# EAGLE schematic VCAMixer (EAGLE 7.6.0)
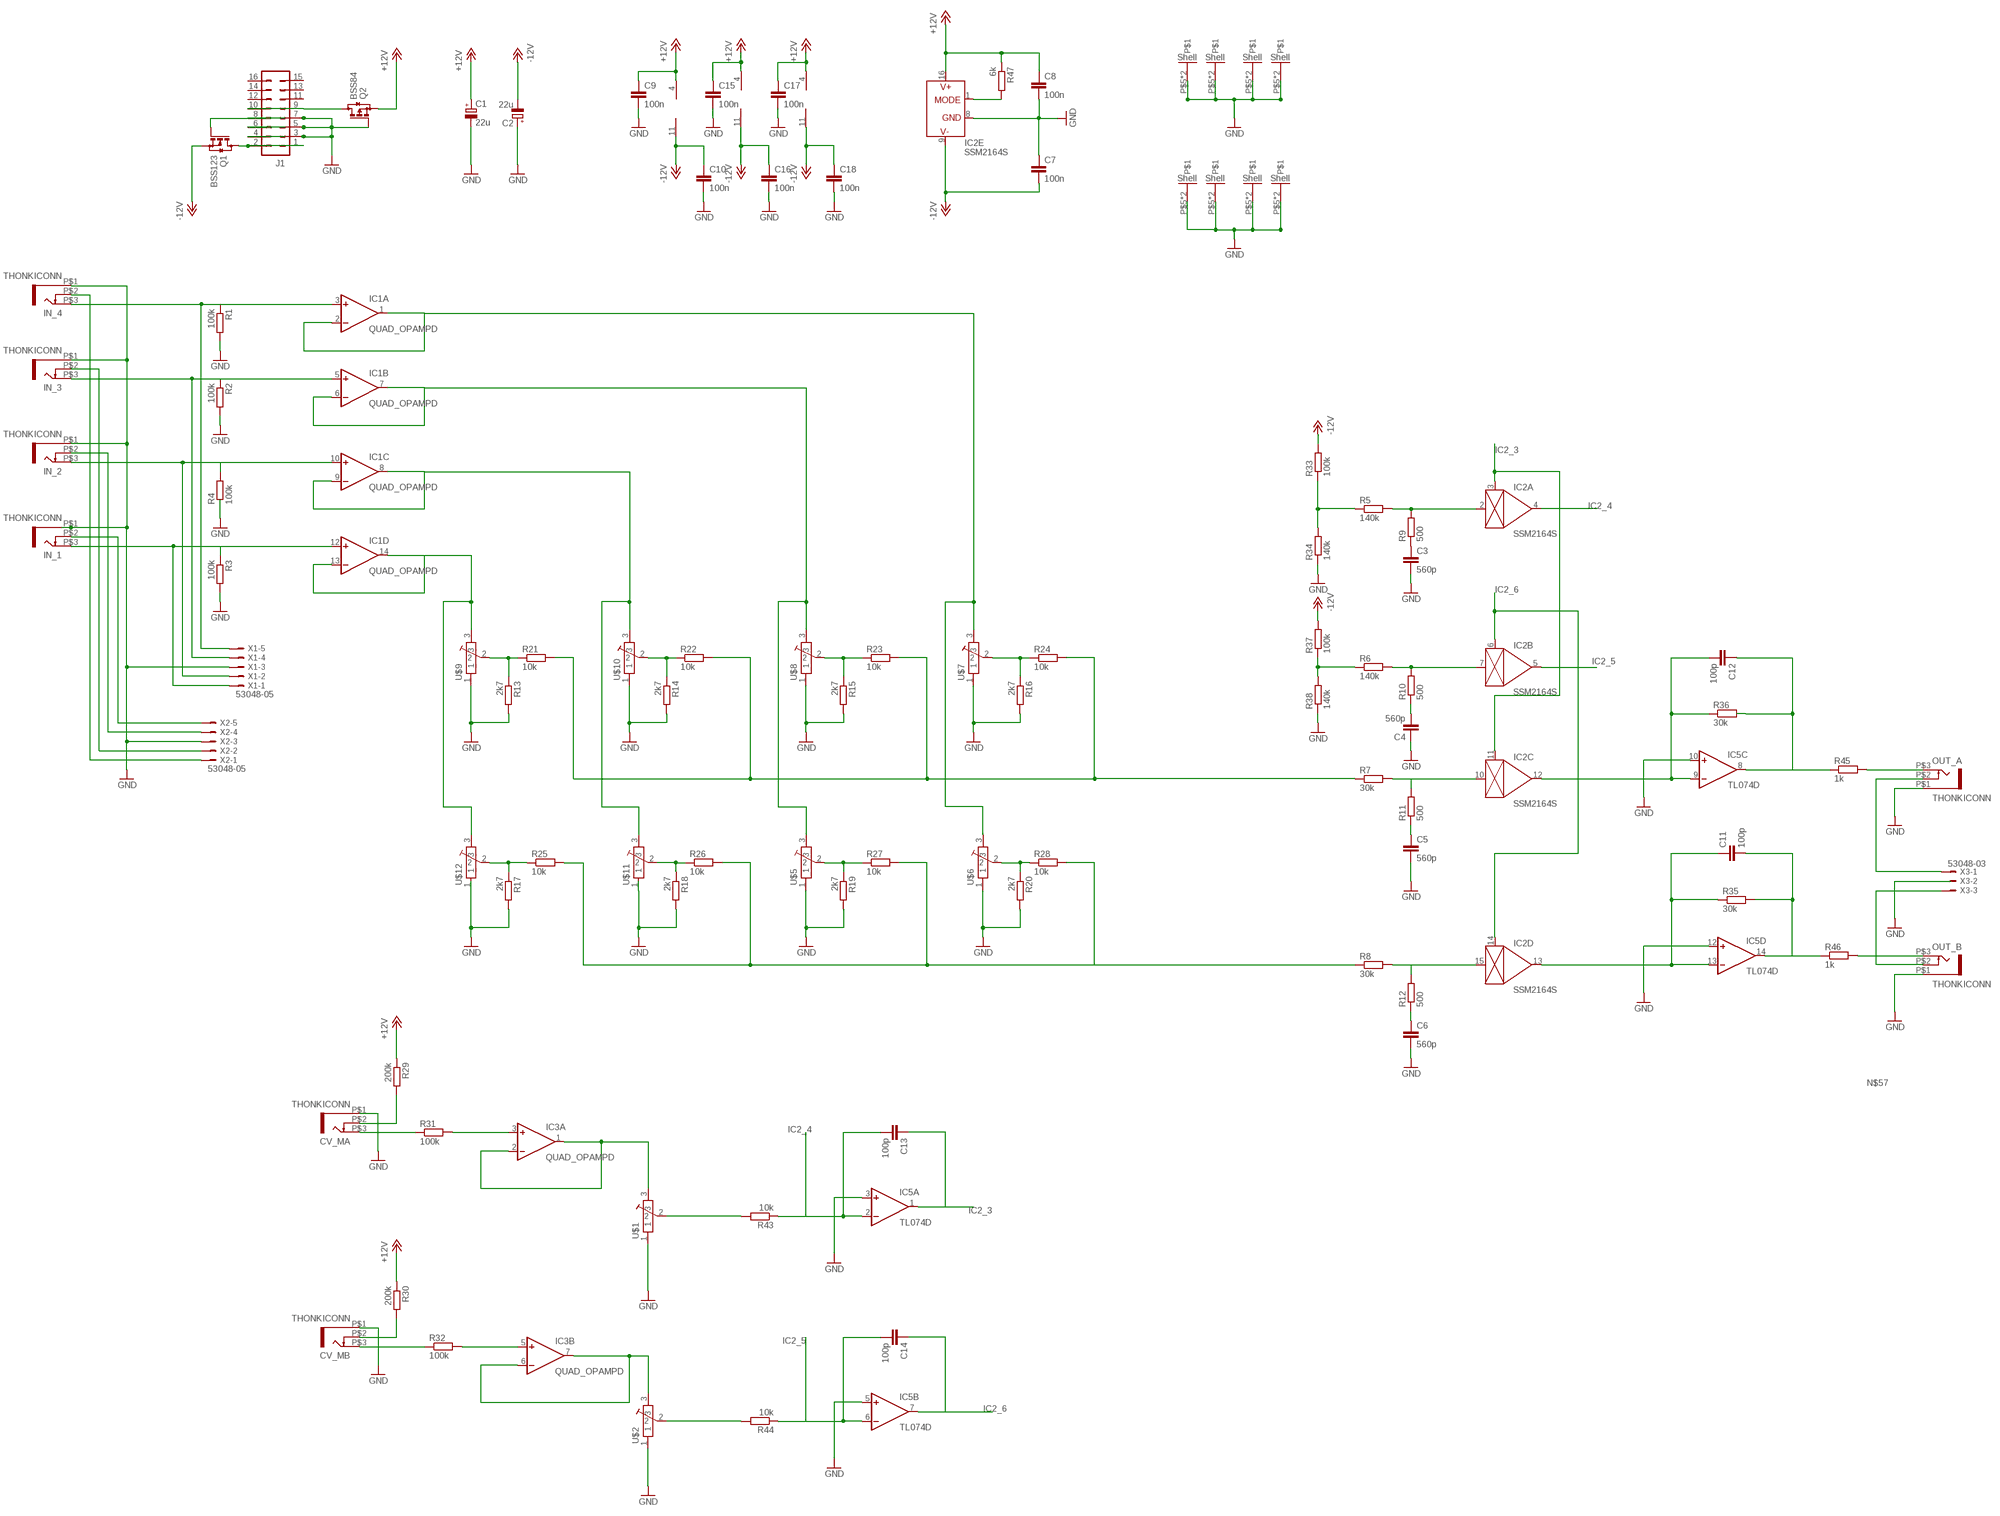
[diagram p0: schematic, sheet 1]

## Parts
C1  22u  CPOL-EU153CLV-0505  [153CLV-0505]
C2  22u  CPOL-EU153CLV-0505  [153CLV-0505]
C3  560p  C-EUC0603K  [C0603K]
C4  560p  C-EUC0603K  [C0603K]
C5  560p  C-EUC0603K  [C0603K]
C6  560p  C-EUC0603K  [C0603K]
C7  100n  C-EUC0603K  [C0603K]
C8  100n  C-EUC0603K  [C0603K]
C9  100n  C-EUC0603K  [C0603K]
C10  100n  C-EUC0603K  [C0603K]
C11  100p  C-EUC0603K  [C0603K]
C12  100p  C-EUC0603K  [C0603K]
C13  100p  C-EUC0603K  [C0603K]
C14  100p  C-EUC0603K  [C0603K]
C15  100n  C-EUC0603K  [C0603K]
C16  100n  C-EUC0603K  [C0603K]
C17  100n  C-EUC0603K  [C0603K]
C18  100n  C-EUC0603K  [C0603K]
CV_MA  THONKICONN  [THONKICONN]
CV_MB  THONKICONN  [THONKICONN]
IC1  QUAD_OPAMPD  [SO14]
IC2  SSM2164S  [SOIC16N]
IC3  QUAD_OPAMPD  [SO14]
IC5  TL074D  [SO14]
IN_1  THONKICONN  [THONKICONN]
IN_2  THONKICONN  [THONKICONN]
IN_3  THONKICONN  [THONKICONN]
IN_4  THONKICONN  [THONKICONN]
J1  M08X2  [2X8]
OUT_A  THONKICONN  [THONKICONN]
OUT_B  THONKICONN  [THONKICONN]
Q1  BSS123  [SOT23]
Q2  BSS84  [SOT23]
R1  100k  R-EU_0603  [0603]
R2  100k  R-EU_0603  [0603]
R3  100k  R-EU_0603  [0603]
R4  100k  R-EU_0603  [0603]
R5  140k  R-EU_0603  [0603]
R6  140k  R-EU_0603  [0603]
R7  30k  R-EU_0603  [0603]
R8  30k  R-EU_0603  [0603]
R9  500  R-EU_0603  [0603]
R10  500  R-EU_0603  [0603]
R11  500  R-EU_0603  [0603]
R12  500  R-EU_0603  [0603]
R13  2k7  R-EU_0603  [0603]
R14  2k7  R-EU_0603  [0603]
R15  2k7  R-EU_0603  [0603]
R16  2k7  R-EU_0603  [0603]
R17  2k7  R-EU_0603  [0603]
R18  2k7  R-EU_0603  [0603]
R19  2k7  R-EU_0603  [0603]
R20  2k7  R-EU_0603  [0603]
R21  10k  R-EU_0603  [0603]
R22  10k  R-EU_0603  [0603]
R23  10k  R-EU_0603  [0603]
R24  10k  R-EU_0603  [0603]
R25  10k  R-EU_0603  [0603]
R26  10k  R-EU_0603  [0603]
R27  10k  R-EU_0603  [0603]
R28  10k  R-EU_0603  [0603]
R29  200k  R-EU_0603  [0603]
R30  200k  R-EU_0603  [0603]
R31  100k  R-EU_0603  [0603]
R32  100k  R-EU_0603  [0603]
R33  100k  R-EU_0603  [0603]
R34  140k  R-EU_0603  [0603]
R35  30k  R-EU_0603  [0603]
R36  30k  R-EU_0603  [0603]
R37  100k  R-EU_0603  [0603]
R38  140k  R-EU_0603  [0603]
R43  10k  R-EU_0603  [0603]
R44  10k  R-EU_0603  [0603]
R45  1k  R-EU_0603  [0603]
R46  1k  R-EU_0603  [0603]
R47  6k  R-EU_0603  [0603]
U$1  POT-ALPS-RK09L1140  [POT-ALPS-RK09L1140]
U$2  POT-ALPS-RK09L1140  [POT-ALPS-RK09L1140]
U$5  POT-ALPS-RK09L1140  [POT-ALPS-RK09L1140]
U$6  POT-ALPS-RK09L1140  [POT-ALPS-RK09L1140]
U$7  POT-ALPS-RK09L1140  [POT-ALPS-RK09L1140]
U$8  POT-ALPS-RK09L1140  [POT-ALPS-RK09L1140]
U$9  POT-ALPS-RK09L1140  [POT-ALPS-RK09L1140]
U$10  POT-ALPS-RK09L1140  [POT-ALPS-RK09L1140]
U$11  POT-ALPS-RK09L1140  [POT-ALPS-RK09L1140]
U$12  POT-ALPS-RK09L1140  [POT-ALPS-RK09L1140]
X1  53048-05  [53048-05]
X2  53048-05  [53048-05]
X3  53048-03  [53048-03]

## Nets
+12V: C1.+ C8.1 C9.1 C15.1 C17.1 IC1.4(P:V+) IC2.16(E:V+) IC3.4(P:V+) IC5.4(P:V+) Q2.2(S) R29.1 R30.1 R47.1
-10V: R5.1 R33.1 R34.2
-12V: C2.- C7.2 C10.1 C16.1 C18.1 IC1.11(P:V-) IC2.9(E:V-) IC3.11(P:V-) IC5.11(P:V-) Q1.2(S) R33.2 R37.2
GND: C1.- C2.+ C3.2 C4.1 C5.2 C6.2 C7.1 C8.2 C9.2 C10.2 C15.2 C16.2 C17.2 C18.2 CV_MA.P$1 CV_MB.P$1 IC2.8(E:GND) IC5.3(A:+IN) IC5.5(B:+IN) IC5.10(C:+IN) IC5.12(D:+IN) IN_1.P$1 IN_2.P$1 IN_3.P$1 IN_4.P$1 J1.3 J1.5 J1.7 OUT_A.P$1 OUT_B.P$1 Q2.1(G) R1.2 R2.2 R3.2 R13.2 R14.2 R15.2 R16.2 R17.2 R18.2 R19.2 R20.2 R34.1 R38.1 U$1.1 U$2.1 U$5.1 U$5.P$5 U$5.P$6 U$6.1 U$6.P$5 U$6.P$6 U$7.1 U$7.P$5 U$7.P$6 U$8.1 U$8.P$5 U$8.P$6 U$9.1 U$9.P$5 U$9.P$6 U$10.1 U$10.P$5 U$10.P$6 U$11.1 U$11.P$5 U$11.P$6 U$12.1 U$12.P$5 U$12.P$6 X1.3 X2.3
IC2_3: C13.1 IC2.3(A:CTRL) IC2.11(C:CTRL) IC5.1(A:OUT)
IC2_4: C13.2 IC2.4(A:OUT) IC5.2(A:-IN) R43.1
IC2_5: C14.2 IC2.5(B:OUT) IC5.6(B:-IN) R44.1
IC2_6: C14.1 IC2.6(B:CTRL) IC2.14(D:CTRL) IC5.7(B:OUT)
N$1: J1.1 J1.2 Q1.3(D)
N$2: J1.8 Q1.1(G)
N$3: J1.6
N$4: J1.4
N$5: IN_2.P$2 X2.4
N$6: J1.9 J1.10 Q2.3(D)
N$7: IN_4.P$2 X2.1
N$8: IN_1.P$2 X2.5
N$9: IN_3.P$2 X2.2
N$10: IC1.3(A:+IN) IN_4.P$3 R1.1 X1.5
N$11: IC1.5(B:+IN) IN_3.P$3 R2.1 X1.4
N$12: IC1.10(C:+IN) IN_2.P$3 R4.2 X1.2
N$13: IC1.12(D:+IN) IN_1.P$3 R3.1 X1.1
N$14: IC1.13(D:-IN) IC1.14(D:OUT) U$9.3 U$12.3
N$15: IC1.8(C:OUT) IC1.9(C:-IN) U$10.3 U$11.3
N$16: IC1.6(B:-IN) IC1.7(B:OUT) U$5.3 U$8.3
N$17: IC1.1(A:OUT) IC1.2(A:-IN) U$6.3 U$7.3
N$18: IC2.2(A:IN) R5.2 R9.2
N$19: C5.1 R11.1
N$20: C3.1 R9.1
N$21: IC2.7(B:IN) R6.2 R10.2
N$22: C4.2 R10.1
N$23: IC2.10(C:IN) R7.2 R11.2
N$24: IC2.15(D:IN) R8.2 R12.2
N$25: C6.1 R12.1
N$26: R7.1 R21.2 R22.2 R23.2 R24.2
N$27: CV_MB.P$2 R30.2
N$28: R8.1 R25.2 R26.2 R27.2 R28.2
N$29: R13.1 R21.1 U$9.2
N$30: R14.1 R22.1 U$10.2
N$31: CV_MA.P$2 R29.2
N$32: R15.1 R23.1 U$8.2
N$33: R18.1 R26.1 U$11.2
N$34: R16.1 R24.1 U$7.2
N$35: R19.1 R27.1 U$5.2
N$36: R17.1 R25.1 U$12.2
N$37: CV_MA.P$3 R31.1
N$38: R20.1 R28.1 U$6.2
N$39: IC3.3(A:+IN) R31.2
N$40: CV_MB.P$3 R32.1
N$41: IC3.5(B:+IN) R32.2
N$42: IC3.1(A:OUT) IC3.2(A:-IN) U$1.3
N$43: IC3.6(B:-IN) IC3.7(B:OUT) U$2.3
N$44: OUT_A.P$3 R45.2
N$45: C11.1 IC2.13(D:OUT) IC5.13(D:-IN) R35.1
N$46: C11.2 IC5.14(D:OUT) R35.2 R46.1
N$47: OUT_B.P$3 R46.2
N$48: OUT_A.P$2 X3.1
N$49: C12.2 IC2.12(C:OUT) IC5.9(C:-IN) R36.1
N$50: R43.2 U$1.2
N$51: C12.1 IC5.8(C:OUT) R36.2 R45.1
N$52: R44.2 U$2.2
N$53: R6.1 R37.1 R38.2
N$57: OUT_B.P$2 X3.3
N$59: IC2.1(E:MODE) R47.2
Unconnected: IC3.8(C:OUT) IC3.9(C:-IN) IC3.10(C:+IN) IC3.12(D:+IN) IC3.13(D:-IN) IC3.14(D:OUT) J1.11 J1.12 J1.13 J1.14 J1.15 J1.16 R4.1 U$1.P$5 U$1.P$6 U$2.P$5 U$2.P$6 X3.2

## Library data of the parts
C1 C2 = rcl:CPOL-EU: POLARIZED CAPACITOR, European symbol
C3-C18 = resistor:C-EU: CAPACITOR, European symbol
CV_MA CV_MB IN_1-IN_4 OUT_A OUT_B = Rebel:THONKICONN
IC1 IC3 = adafruit:QUAD_OPAMP: OP AMP Standard quad package
IC2 = ssm2164:SSM2164
IC5 = linear:TL074: OP AMP
J1 = SparkFun-Connectors:M08X2: .1" headers, two rows of 8 each
Q1 = transistor-small-signal:BSS123: N-CHANNEL MOS FET
Q2 = transistor-small-signal:BSS84: P-CHANNEL MOS FET
R1-R38 R43-R47 = Rebel:R-EU_: RESISTOR, European symbol
U$1 U$2 U$5-U$12 = Rebel:POT-ALPS-RK09L
X1 X2 = con-molex:53?-05: CONNECTOR wire to board 1.25 mm (.049 inch) pitch header; MF: MOLEX; MPN: 53048-0510; OC_FARNELL: 9732926; OC_NEWARK: 57H4722
X3 = con-molex:53?-03: CONNECTOR wire to board 1.25 mm (.049 inch) pitch header; MF: WALDOM/MOLEX; MPN: 53048-0310; OC_FARNELL: 9732918; OC_NEWARK: 38C9908